# Altium schematic sheet zasilanie.SchDoc
size A4
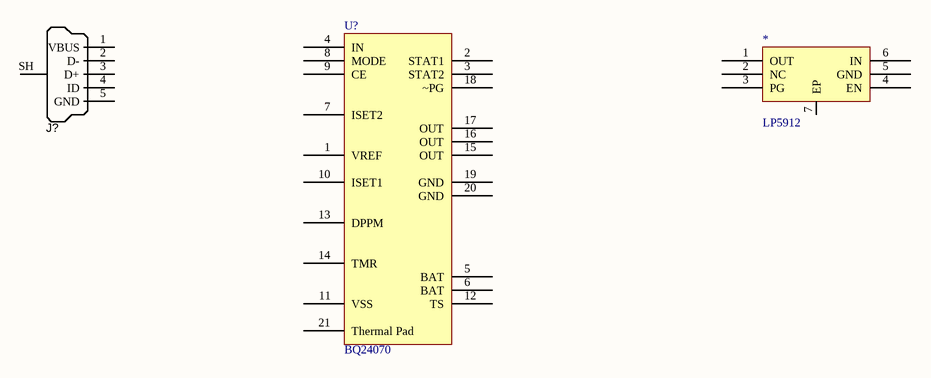
[diagram p0: zasilanie.SchDoc]

## Parts
*  LP5912  [WSON-6]
J?  USB Micro Type B  [USB_Micro-B]  (value not drawn)
U?  BQ24070  [BQ24070]

## Nets

Not connected (* = marked no-connect by the designer): * 1(OUT) 2(NC) 3(PG) 4(EN) 5(GND) 6(IN) 7(EP); J? 1(VBUS) 2(D-) 3(D+) 4(ID) 5(GND) SH(Shell); U? 1(VREF) 2(STAT1) 3(STAT2) 4(IN) 5(BAT) 6(BAT) 7(ISET2) 8(MODE) 9(CE) 10(ISET1) 11(VSS) 12(TS) 13(DPPM) 14(TMR) 15(OUT) 16(OUT) 17(OUT) 18(~PG) 19(GND) 20(GND) 21(Thermal_Pad)

## Library data of the parts
J? = USB_Micro_TypeB: Connector SMD USB Micro Type B middle mount; Manufacturer 1: Molex Inc; SCDType: undef; Package / Case: SMD; Supplier 1: Digi-Key; Supplier Part Number 1: WM17142CT-ND